# Altium schematic sheet SchEmbeddedSystemDesign.SchDoc
size 304 x 241 mm; SheetNumber: 1; SheetTotal: 1
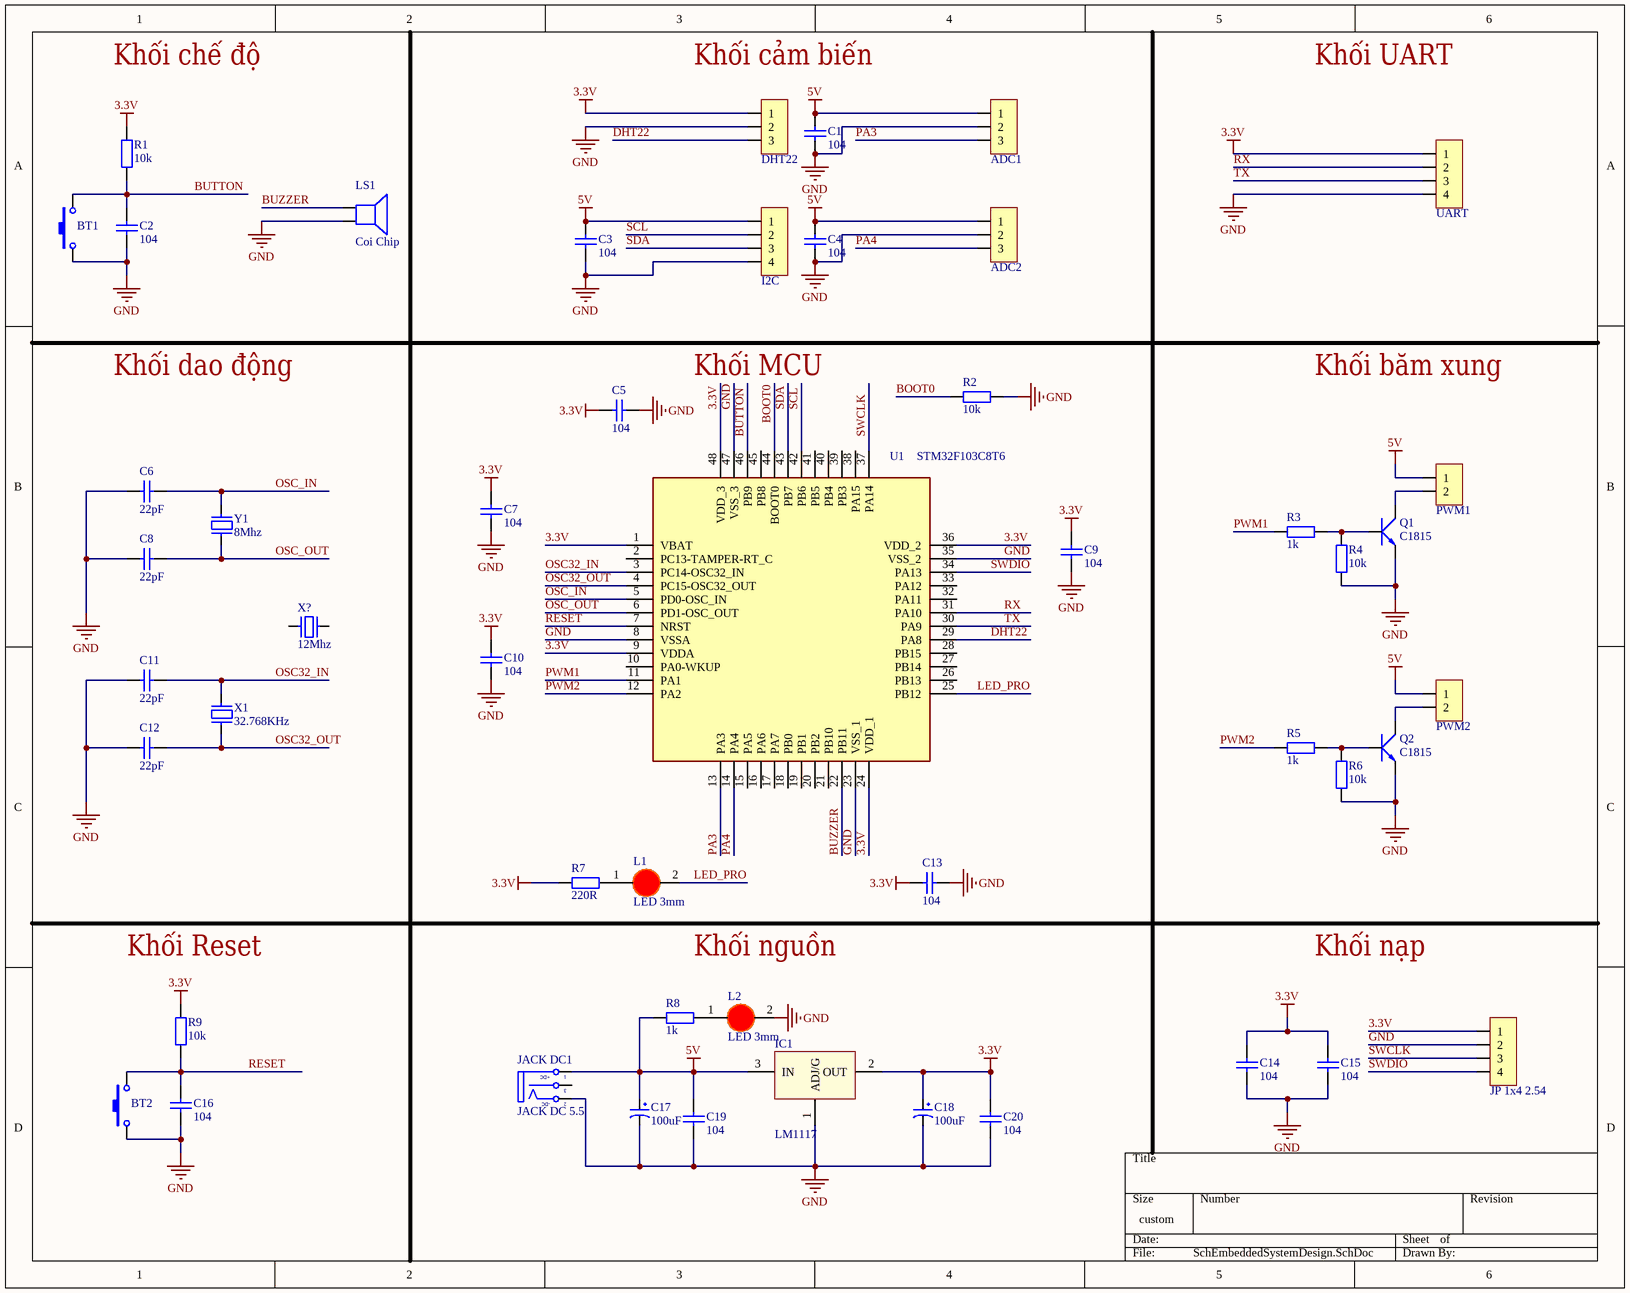
[diagram p0: SchEmbeddedSystemDesign.SchDoc]

## Parts
BT1  Nut Nhan 2 Chan SMD 3x6x2.5  [Nut Nhan 2 Chan SMD 3x6x2.5]  (value not drawn)
BT2  Nut Nhan 2 Chan SMD 3x6x2.5  [Nut Nhan 2 Chan SMD 3x6x2.5]  (value not drawn)
C1  104  [tu gom]
C2  104  [tu gom]
C3  104  [tu gom]
C4  104  [tu gom]
C5  104  [tu gom]
C6  22pF  [tu gom]
C7  104  [tu gom]
C8  22pF  [tu gom]
C9  104  [tu gom]
C10  104  [tu gom]
C11  22pF  [tu gom]
C12  22pF  [tu gom]
C13  104  [tu gom]
C14  104  [tu gom]
C15  104  [tu gom]
C16  104  [tu gom]
C17  100uF  [tu hoa 5mm]
C18  100uF  [tu hoa 5mm]
C19  104  [tu gom]
C20  104  [tu gom]
IC1  LM1117  [SOT223-4N]
JACK_DC1  JACK DC 5.5  [JACK DC 5.5]
JP1  DHT22  [JP 1x3 DT]
JP2  ADC1  [JP 1x3 DT]
JP3  UART  [JP 1x4 DT]
JP4  I2C  [JP 1x4 DT]
JP5  ADC2  [JP 1x3 DT]
JP6  PWM1  [JP 1x2 DT]
JP7  PWM2  [JP 1x2 DT]
JP8  JP 1x4 2.54  [JP 1x4 DT]
L1  LED 3mm  [LED-3MM-RED]
L2  LED 3mm  [LED-3MM-RED]
LS1  Coi Chip  [Coi Chip Speacker]
Q1  C1815  [TO92]
Q2  C1815  [TO92]
R1  10k  [tro vach 1/4w]
R2  10k  [tro vach 1/4w]
R3  1k  [tro vach 1/4w]
R4  10k  [tro vach 1/4w]
R5  1k  [tro vach 1/4w]
R6  10k  [tro vach 1/4w]
R7  220R  [tro vach 1/4w]
R8  1k  [tro vach 1/4w]
R9  10k  [tro vach 1/4w]
U1  STM32F103C8T6  [LQFP-48_19.6_393_58X11_SMD]
X1  32.768KHz  [XT2-32.768KHz-2_V]
X?  12Mhz  [XT2-SMD]
Y1  8Mhz  [Thach Anh 2 chan cam]

## Nets
3.3V: C5.1 C7.1 C9.1 C10.1 C13.1 C14.2 C15.2 C18.1 C20.2 IC1.2(OUT) JP1.1 JP3.1 JP8.1 R1.1 R7.1 R9.1 U1.1(VBAT) U1.9(VDDA) U1.24(VDD_1) U1.36(VDD_2) U1.48(VDD_3)
5V: C1.1 C3.1 C4.1 C17.1 C19.2 IC1.3(IN) JACK_DC1.1(T) JP2.1 JP4.1 JP5.1 JP6.1 JP7.1 R8.1
GND: BT1.1 BT2.1 C1.2 C2.1 C3.2 C4.2 C5.2 C6.2 C7.2 C8.2 C9.2 C10.2 C11.2 C12.2 C13.2 C14.1 C15.1 C16.1 C17.2 C18.2 C19.1 C20.1 IC1.1(ADJ/G) JACK_DC1.2(TN) JP1.2 JP2.2 JP3.4 JP4.4 JP5.2 JP8.2 L2.2(K) LS1.2 Q1.1(E) Q2.1(E) R2.2 R4.2 R6.2 U1.8(VSSA) U1.23(VSS_1) U1.35(VSS_2) U1.47(VSS_3)
BOOT0: R2.1 U1.44(BOOT0)
BUTTON: BT1.2 C2.2 R1.2 U1.46(PB9)
BUZZER: LS1.1 U1.22(PB11)
DHT22: JP1.3 U1.29(PA8)
LED_PRO: L1.2(K) U1.25(PB12)
OSC32_IN: C11.1 U1.3(PC14-OSC32_IN) X1.2
OSC32_OUT: C12.1 U1.4(PC15-OSC32_OUT) X1.1
OSC_IN: C6.1 U1.5(PD0-OSC_IN) Y1.2
OSC_OUT: C8.1 U1.6(PD1-OSC_OUT) Y1.1
PA3: JP2.3 U1.13(PA3)
PA4: JP5.3 U1.14(PA4)
PWM1: R3.1 U1.11(PA1)
PWM2: R5.1 U1.12(PA2)
RESET: BT2.2 C16.2 R9.2 U1.7(NRST)
RX: JP3.2 U1.31(PA10)
SCL: JP4.2 U1.42(PB6)
SDA: JP4.3 U1.43(PB7)
SWCLK: JP8.3 U1.37(PA14)
SWDIO: JP8.4 U1.34(PA13)
TX: JP3.3 U1.30(PA9)
NetJP6_2: JP6.2 Q1.2(C)
NetJP7_2: JP7.2 Q2.2(C)
NetL1_1: L1.1(A) R7.2
NetL2_1: L2.1(A) R8.2
NetQ1_3: Q1.3(B) R3.2 R4.1
NetQ2_3: Q2.3(B) R5.2 R6.1

Not connected (* = marked no-connect by the designer): JACK_DC1 3(S); U1 2(PC13-TAMPER-RT_C) 10(PA0-WKUP) 15(PA5) 16(PA6) 17(PA7) 18(PB0) 19(PB1) 20(PB2) 21(PB10) 26(PB13) 27(PB14) 28(PB15) 32(PA11) 33(PA12) 38(PA15) 39(PB3) 40(PB4) 41(PB5) 45(PB8); X? 1 2

## Notes on the sheet
- Khối chế độ
- Khối cảm biến
- Khối UART
- Khối dao động
- Khối MCU
- Khối băm xung
- Khối Reset
- Khối nguồn
- Khối nạp
- (in symbol JACK DC 5.5) +DC; -DC

## Library data of the parts
BT1 BT2 = Nut Nhan 2 Chan SMD 3x6x2.5: Ma_Hang: MH001036; Ten: Nút Nhấn 2 Chân 3x6x2.5MM SMD
C1-C5 C7 C9 C10 C13-C16 C19 C20 = Tu gom 104 50V: Cắm; So_Chan: 2; Ten_Linh_Kien: Tụ gốm 104 100nF 50V; Don_Vi: Con; Ma_Hang: MH004761; Chung_Loai: Cắm; Kieu_Chan: *
C6 C8 C11 C12 = Tu gom 22pF 50V: Cắm; Don_Vi: Con; So_Chan: 2; Ten_Linh_Kien: Tụ gốm 22P 50V; Ma_Hang: MH004771; Chung_Loai: Cắm; Kieu_Chan: *
C17 C18 = Tu Hoa 100uF 16V 5x11: Cắm; Don_Vi: Con; So_Chan: 2; Ten_Linh_Kien: Tụ Hóa 100uF 16V 5x11MM; Ma_Hang: MH008417; Chung_Loai: Cắm; Kieu_Chan: *
IC1 = LM1117: Available in 1.8V, 2.5V, 2.85V, 3.3V, 5V, and  Adjustable Versions; Value: LM317
JACK_DC1 = JACK DC 5.5: Value: Jac DC
JP1 JP2 JP5 = JP 1x3 2.54 Duc Thang: Cắm; Ten_Linh_Kien: Jump Đơn Đực 2.54MM 1x40P Thẳng 11MM; Don_Vi: Con; Ma_Hang: MH000903; Ghi_Chu: *; Kieu_Chan: *; Chung_Loai: Cắm
JP3 JP4 JP8 = JP 1x4 2.54 Duc Thang: Cắm; Ten_Linh_Kien: Jump Đơn Đực 2.54MM 1x40P Thẳng 11MM; Don_Vi: Con; Ma_Hang: MH000903; Ghi_Chu: *; Kieu_Chan: *; Chung_Loai: Cắm
JP6 JP7 = JP 1x2 2.54 Duc Thang: Cắm; Ten_Linh_Kien: Jump Đơn Đực 2.54MM 1x40P Thẳng 11MM; Don_Vi: Con; Ma_Hang: MH000903; Ghi_Chu: *; Kieu_Chan: *; Chung_Loai: Cắm
L1 L2 = LED 3mm Do: Cắm; Don_Vi: Con; Ma_Hang: MH003892; Ten_Linh_Kien: Led 3MM Phủ Đỏ (10c); Ghi_Chu: *; Kieu_Chan: *; Chung_Loai: Cắm
LS1 = Coi Chip Speaker: Còi chip
Q1 Q2 = C1815: NPN transistor; Value: C9014
R1 R2 R4 R6 R9 = Tro Vach 1/4W 1% 10k: Cắm; Don_Vi: Con; So_Chan: 2; Ten_Linh_Kien: Trở Vạch 1/4w 1% 10k; Ma_Hang: MH006349; Chung_Loai: Cắm; Kieu_Chan: *
R3 R5 R8 = Tro Vach 1/4W 5% 1k: Cắm; Don_Vi: Con; So_Chan: 2; Ten_Linh_Kien: Trở Vạch 1/4w 5% 1k; Ma_Hang: MH007390; Chung_Loai: Cắm; Kieu_Chan: *
R7 = Tro Vach 1/4W 5% 220R: Cắm; Don_Vi: Con; So_Chan: 2; Ten_Linh_Kien: Trở Vạch 1/4w 5% 220R; Ma_Hang: MH007300; Chung_Loai: Cắm; Kieu_Chan: *
U1 = IC_STM32F103C8T6: ARM® Cortex®-M3 STM32F1 Microcontroller IC 32-Bit 72MHz 64KB (64K x 8) FLASH 48-LQFP (7x7) /; Manufacturer: STMicroelectronics; Alternate Part Number-1: NA; Manufacturer Part Number: STM32F103C8T6; Case/Package: LQFP48; Supplier-1: LCSC; Supplier Part Number-1: STM32F103C8T6
X1 X? = XT2: Crystal, 32.768 KHz, -40 to 85 degC, 3.2 x 1.5 x 0.9 mm SMD; Value: 4Mhz
Y1 = Thach Anh 2 chan Cam: Crystal For all Crystal 2pin.; Value: 4Mhz